# Altium project RP2040.PrjPcb
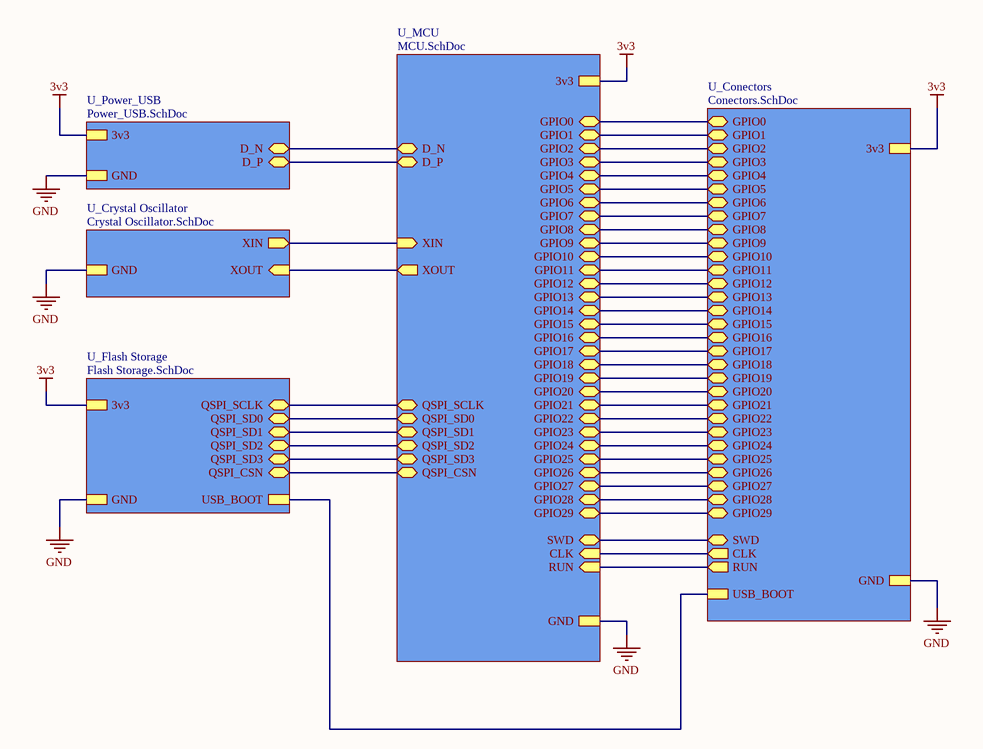
[diagram p0: RP2040.SchDoc]
6 sheets, 30 parts. Net scope: hierarchical (ports join the sheet entries above them; power ports are global).
Board file: RP2040.PcbDoc
Sheets:
  RP2040.SchDoc
    U_Conectors = Conectors.SchDoc
    U_Crystal Oscillator = Crystal Oscillator.SchDoc
    U_Flash Storage = Flash Storage.SchDoc
    U_MCU = MCU.SchDoc
    U_Power_USB = Power_USB.SchDoc

## Sheet RP2040.SchDoc
size A; SheetNumber: 1; SheetTotal: 6

### Sub-sheets
U_Conectors = Conectors.SchDoc: GPIO0 (bidir), GPIO1 (bidir), GPIO2 (bidir), GPIO3 (bidir), GPIO4 (bidir), GPIO5 (bidir), GPIO6 (bidir), GPIO7 (bidir), GPIO8 (bidir), GPIO9 (bidir), GPIO10 (bidir), GPIO11 (bidir), GPIO12 (bidir), GPIO13 (bidir), GPIO14 (bidir), GPIO15 (bidir), CLK (out), SWD (bidir), RUN (out), GPIO16 (bidir), GPIO17 (bidir), GPIO18 (bidir), GPIO19 (bidir), GPIO20 (bidir), GPIO21 (bidir), GPIO22 (bidir), GPIO23 (bidir), GPIO24 (bidir), GPIO25 (bidir), GPIO26 (bidir), GPIO27 (bidir), GPIO28 (bidir), GPIO29 (bidir), USB_BOOT, 3v3, GND
U_Crystal Oscillator = Crystal Oscillator.SchDoc: XIN (out), XOUT (in), GND
U_Flash Storage = Flash Storage.SchDoc: USB_BOOT, QSPI_SCLK (bidir), QSPI_SD0 (bidir), QSPI_SD1 (bidir), QSPI_SD2 (bidir), QSPI_SD3 (bidir), QSPI_CSN (bidir), 3v3, GND
U_MCU = MCU.SchDoc: GPIO0 (bidir), GPIO1 (bidir), GPIO2 (bidir), GPIO3 (bidir), GPIO4 (bidir), GPIO5 (bidir), GPIO6 (bidir), GPIO7 (bidir), GPIO8 (bidir), GPIO9 (bidir), GPIO10 (bidir), GPIO11 (bidir), GPIO12 (bidir), GPIO13 (bidir), GPIO14 (bidir), GPIO15 (bidir), SWD (bidir), RUN (in), GPIO16 (bidir), GPIO17 (bidir), GPIO18 (bidir), GPIO19 (bidir), GPIO20 (bidir), GPIO21 (bidir), GPIO22 (bidir), GPIO23 (bidir), GPIO24 (bidir), GPIO25 (bidir), GPIO26 (bidir), GPIO27 (bidir), GPIO28 (bidir), GPIO29 (bidir), CLK (in), XOUT (out), XIN (in), QSPI_SCLK (bidir), QSPI_SD0 (bidir), QSPI_SD1 (bidir), QSPI_SD2 (bidir), QSPI_SD3 (bidir), QSPI_CSN (bidir), 3v3, GND, D_N (bidir), D_P (bidir)
U_Power_USB = Power_USB.SchDoc: GND, 3v3, D_N (bidir), D_P (bidir)

### Nets
3v3: sheet U_Conectors/3v3, sheet U_Flash Storage/3v3, sheet U_MCU/3v3, sheet U_Power_USB/3v3
GND: sheet U_Conectors/GND, sheet U_Crystal Oscillator/GND, sheet U_Flash Storage/GND, sheet U_MCU/GND, sheet U_Power_USB/GND
CLK: sheet U_Conectors/CLK, sheet U_MCU/CLK
D_N: sheet U_MCU/D_N, sheet U_Power_USB/D_N
D_P: sheet U_MCU/D_P, sheet U_Power_USB/D_P
GPIO0: sheet U_Conectors/GPIO0, sheet U_MCU/GPIO0
GPIO1: sheet U_Conectors/GPIO1, sheet U_MCU/GPIO1
GPIO2: sheet U_Conectors/GPIO2, sheet U_MCU/GPIO2
GPIO3: sheet U_Conectors/GPIO3, sheet U_MCU/GPIO3
GPIO4: sheet U_Conectors/GPIO4, sheet U_MCU/GPIO4
GPIO5: sheet U_Conectors/GPIO5, sheet U_MCU/GPIO5
GPIO6: sheet U_Conectors/GPIO6, sheet U_MCU/GPIO6
GPIO7: sheet U_Conectors/GPIO7, sheet U_MCU/GPIO7
GPIO8: sheet U_Conectors/GPIO8, sheet U_MCU/GPIO8
GPIO9: sheet U_Conectors/GPIO9, sheet U_MCU/GPIO9
GPIO10: sheet U_Conectors/GPIO10, sheet U_MCU/GPIO10
GPIO11: sheet U_Conectors/GPIO11, sheet U_MCU/GPIO11
GPIO12: sheet U_Conectors/GPIO12, sheet U_MCU/GPIO12
GPIO13: sheet U_Conectors/GPIO13, sheet U_MCU/GPIO13
GPIO14: sheet U_Conectors/GPIO14, sheet U_MCU/GPIO14
GPIO15: sheet U_Conectors/GPIO15, sheet U_MCU/GPIO15
GPIO16: sheet U_Conectors/GPIO16, sheet U_MCU/GPIO16
GPIO17: sheet U_Conectors/GPIO17, sheet U_MCU/GPIO17
GPIO18: sheet U_Conectors/GPIO18, sheet U_MCU/GPIO18
GPIO19: sheet U_Conectors/GPIO19, sheet U_MCU/GPIO19
GPIO20: sheet U_Conectors/GPIO20, sheet U_MCU/GPIO20
GPIO21: sheet U_Conectors/GPIO21, sheet U_MCU/GPIO21
GPIO22: sheet U_Conectors/GPIO22, sheet U_MCU/GPIO22
GPIO23: sheet U_Conectors/GPIO23, sheet U_MCU/GPIO23
GPIO24: sheet U_Conectors/GPIO24, sheet U_MCU/GPIO24
GPIO25: sheet U_Conectors/GPIO25, sheet U_MCU/GPIO25
GPIO26: sheet U_Conectors/GPIO26, sheet U_MCU/GPIO26
GPIO27: sheet U_Conectors/GPIO27, sheet U_MCU/GPIO27
GPIO28: sheet U_Conectors/GPIO28, sheet U_MCU/GPIO28
GPIO29: sheet U_Conectors/GPIO29, sheet U_MCU/GPIO29
QSPI_CSN: sheet U_Flash Storage/QSPI_CSN, sheet U_MCU/QSPI_CSN
QSPI_SCLK: sheet U_Flash Storage/QSPI_SCLK, sheet U_MCU/QSPI_SCLK
QSPI_SD0: sheet U_Flash Storage/QSPI_SD0, sheet U_MCU/QSPI_SD0
QSPI_SD1: sheet U_Flash Storage/QSPI_SD1, sheet U_MCU/QSPI_SD1
QSPI_SD2: sheet U_Flash Storage/QSPI_SD2, sheet U_MCU/QSPI_SD2
QSPI_SD3: sheet U_Flash Storage/QSPI_SD3, sheet U_MCU/QSPI_SD3
RUN: sheet U_Conectors/RUN, sheet U_MCU/RUN
SWD: sheet U_Conectors/SWD, sheet U_MCU/SWD
USB_BOOT: sheet U_Conectors/USB_BOOT, sheet U_Flash Storage/USB_BOOT
XIN: sheet U_Crystal Oscillator/XIN, sheet U_MCU/XIN
XOUT: sheet U_Crystal Oscillator/XOUT, sheet U_MCU/XOUT

## Sheet Conectors.SchDoc
size A; SheetNumber: 3; SheetTotal: 6
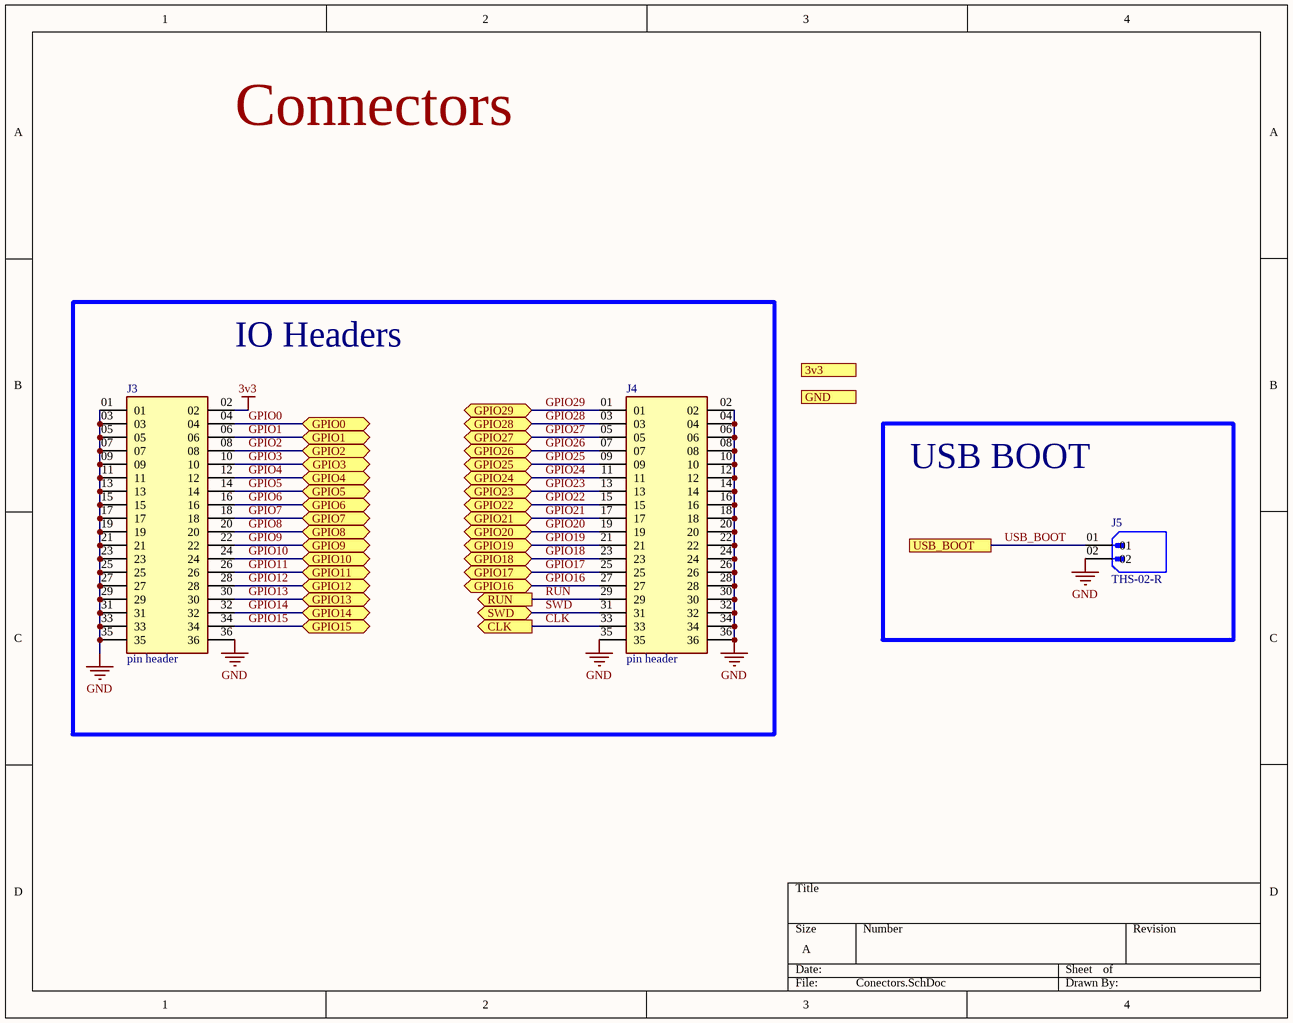
[diagram p1: Conectors.SchDoc]

### Parts
J3  pin header  [MTSW-118-07-T-D-150]
J4  pin header  [MTSW-118-07-T-D-150]
J5  THS-02-R  [THS-02-R]

### Blocks framed on the sheet
IO Headers: J3 J4
USB BOOT: J5

### Ports
3v3, CLK (out), GND, GPIO0 (bidir), GPIO1 (bidir), GPIO2 (bidir), GPIO3 (bidir), GPIO4 (bidir), GPIO5 (bidir), GPIO6 (bidir), GPIO7 (bidir), GPIO8 (bidir), GPIO9 (bidir), GPIO10 (bidir), GPIO11 (bidir), GPIO12 (bidir), GPIO13 (bidir), GPIO14 (bidir), GPIO15 (bidir), GPIO16 (bidir), GPIO17 (bidir), GPIO18 (bidir), GPIO19 (bidir), GPIO20 (bidir), GPIO21 (bidir), GPIO22 (bidir), GPIO23 (bidir), GPIO24 (bidir), GPIO25 (bidir), GPIO26 (bidir), GPIO27 (bidir), GPIO28 (bidir), GPIO29 (bidir), RUN (out), SWD (bidir), USB_BOOT

### Nets
3v3: J3.02 ; port 3v3
GND: J3.01 J3.03 J3.05 J3.07 J3.09 J3.11 J3.13 J3.15 J3.17 J3.19 J3.21 J3.23 J3.25 J3.27 J3.29 J3.31 J3.33 J3.35 J3.36 J4.02 J4.04 J4.06 J4.08 J4.10 J4.12 J4.14 J4.16 J4.18 J4.20 J4.22 J4.24 J4.26 J4.28 J4.30 J4.32 J4.34 J4.35 J4.36 J5.02 ; port GND
CLK: J4.33 ; port CLK
GPIO0: J3.04 ; port GPIO0
GPIO1: J3.06 ; port GPIO1
GPIO2: J3.08 ; port GPIO2
GPIO3: J3.10 ; port GPIO3
GPIO4: J3.12 ; port GPIO4
GPIO5: J3.14 ; port GPIO5
GPIO6: J3.16 ; port GPIO6
GPIO7: J3.18 ; port GPIO7
GPIO8: J3.20 ; port GPIO8
GPIO9: J3.22 ; port GPIO9
GPIO10: J3.24 ; port GPIO10
GPIO11: J3.26 ; port GPIO11
GPIO12: J3.28 ; port GPIO12
GPIO13: J3.30 ; port GPIO13
GPIO14: J3.32 ; port GPIO14
GPIO15: J3.34 ; port GPIO15
GPIO16: J4.27 ; port GPIO16
GPIO17: J4.25 ; port GPIO17
GPIO18: J4.23 ; port GPIO18
GPIO19: J4.21 ; port GPIO19
GPIO20: J4.19 ; port GPIO20
GPIO21: J4.17 ; port GPIO21
GPIO22: J4.15 ; port GPIO22
GPIO23: J4.13 ; port GPIO23
GPIO24: J4.11 ; port GPIO24
GPIO25: J4.09 ; port GPIO25
GPIO26: J4.07 ; port GPIO26
GPIO27: J4.05 ; port GPIO27
GPIO28: J4.03 ; port GPIO28
GPIO29: J4.01 ; port GPIO29
RUN: J4.29 ; port RUN
SWD: J4.31 ; port SWD
USB_BOOT: J5.01 ; port USB_BOOT

### Notes on the sheet
- Connectors

### Library data of the parts
J3 J4 = MTSW-118-07-T-D-150: 2x18 male pin header; Package: None; Price: None; Value: *; MP: MTSW-118-07-T-D-150; Availability: Unavailable
J5 = THS-02-R: 2x1 male pin header; Value: *; Price: None; Package: None; Availability: Unavailable; MP: THS-02-R

## Sheet Crystal Oscillator.SchDoc
size A; SheetNumber: 6; SheetTotal: 6
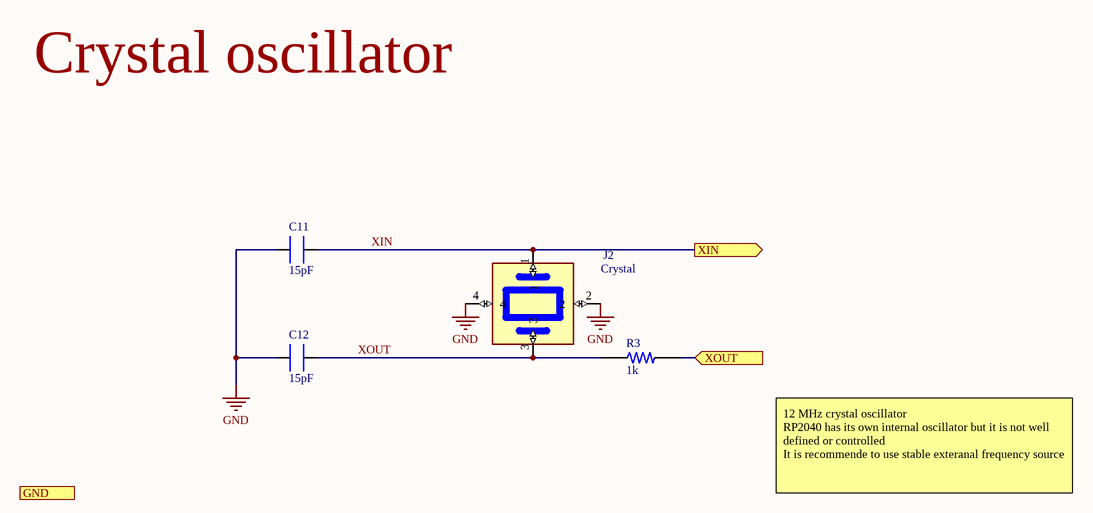
[diagram p2: Crystal Oscillator.SchDoc]

### Parts
C11  15pF  [CC0603JRNPO9BN150]
C12  15pF  [CC0603JRNPO9BN150]
J2  Crystal  [ABM8-272-T3]
R3  1k  [RC0603FR-071KL]

### Ports
GND, XIN (out), XOUT (in)

### Nets
GND: C11.2 C12.2 J2.2 J2.4 ; port GND
XIN: C11.1 J2.1 ; port XIN
XOUT: C12.1 J2.3 R3.1
XOUT: R3.2 ; port XOUT  [a separate net that carries the same name]

### Notes on the sheet
- Crystal oscillator
- 12 MHz crystal oscillator
  RP2040 has its own internal oscillator but it is not well defined or controlled
  It is recommende to use stable exteranal frequency source

### Library data of the parts
C11 C12 = CC0603JRNPO9BN150: 15pF ±5% 50V Ceramic Capacitor C0G, NP0 0603 (1608 Metric); MF: Yageo; Package: 0603 Yageo; MP: CC0603JRNPO9BN150; Purchase-URL: https://pricing.snapeda.com/search/part/CC0603JRNPO9BN150/?ref=eda; Check_prices: https://www.snapeda.com/parts/CC0603JRNPO9BN150/Yageo/view-part/105570/?ref=eda; Value: *; Price: None; Availability: Good; SnapEDA_Link: https://www.snapeda.com/parts/CC0603JRNPO9BN150/Yageo/view-part/105570/?ref=snap
J2 = ABM8-272-T3: 12 MHz  ±30ppm Crystal 10pF 50 Ohms 4-SMD, No Lead; MF: ABRACON; SnapEDA_Link: https://www.snapeda.com/parts/ABM8-272-T3/Abracon/view-part/?ref=snap; Package: SMD-4 Abracon; Value: *; MP: ABM8-272-T3; Check_prices: https://www.snapeda.com/parts/ABM8-272-T3/Abracon/view-part/?ref=eda
R3 = RC0603FR-071KL: 1 kOhms ±1% 0.1W, 1/10W Chip Resistor 0603 (1608 Metric) Moisture Resistant Thick Film; MF: Yageo; SnapEDA_Link: https://www.snapeda.com/parts/RC0603FR-071KL/Yageo/view-part/?ref=snap; Package: 0603 Yageo; Value: *; MP: RC0603FR-071KL; Check_prices: https://www.snapeda.com/parts/RC0603FR-071KL/Yageo/view-part/?ref=eda

## Sheet Flash Storage.SchDoc
size A; SheetNumber: 2; SheetTotal: 6
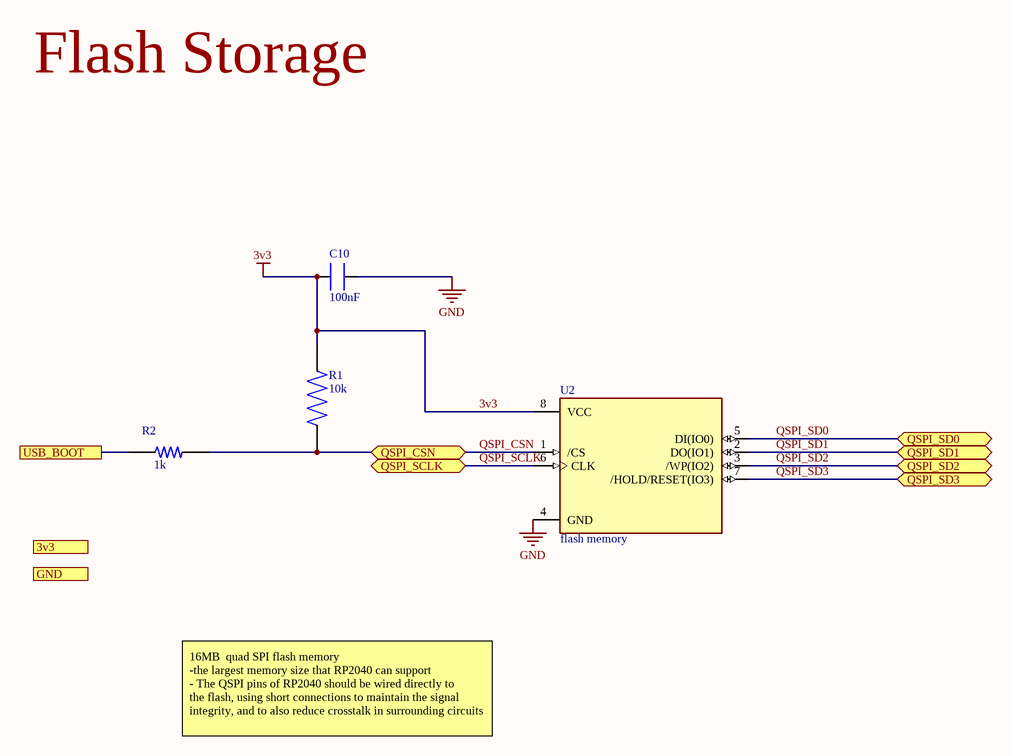
[diagram p3: Flash Storage.SchDoc]

### Parts
C10  100nF  [CL10B104KB8NNNC]
R1  10k  [RMCF0603JT10K0]
R2  1k  [RC0603FR-071KL]
U2  flash memory  [SOIC127P790X216-8N]

### Ports
3v3, GND, QSPI_CSN (bidir), QSPI_SCLK (bidir), QSPI_SD0 (bidir), QSPI_SD1 (bidir), QSPI_SD2 (bidir), QSPI_SD3 (bidir), USB_BOOT

### Nets
3v3: C10.1 R1.2 U2.8(VCC) ; port 3v3
GND: C10.2 U2.4(GND) ; port GND
QSPI_CSN: R1.1 R2.2 U2.1(/CS) ; port QSPI_CSN
QSPI_SCLK: U2.6(CLK) ; port QSPI_SCLK
QSPI_SD0: U2.5(DI(IO0)) ; port QSPI_SD0
QSPI_SD1: U2.2(DO(IO1)) ; port QSPI_SD1
QSPI_SD2: U2.3(/WP(IO2)) ; port QSPI_SD2
QSPI_SD3: U2.7(/HOLD/RESET(IO3)) ; port QSPI_SD3
USB_BOOT: R2.1 ; port USB_BOOT

### Notes on the sheet
- Flash Storage
- 16MB  quad SPI flash memory
  -the largest memory size that RP2040 can support
  - The QSPI pins of RP2040 should be wired directly to
  the flash, using short connections to maintain the signal integrity, and to also reduce crosstalk in surrounding circuits

### Library data of the parts
C10 = CL10B104KB8NNNC: SMD ceramic capacitor 0.1µF, tolerance ±10% 50V 0603 _1608 Metric_; MF: Samsung Electro-Mechanics; Price: None; MP: CL10B104KB8NNNC; SnapEDA_Link: https://www.snapeda.com/parts/CL10B104KB8NNNC/Samsung%20Electro-Mechanics/view-part/3598309/?ref=snap; Availability: Unavailable; Package: 0603 Samsung; Value: *
R1 = RMCF0603JT10K0: 10 kOhms ±5% 0.1W, 1/10W Chip Resistor 0603 (1608 Metric) Automotive AEC-Q200 Thick Film; Package: None; Price: None; Value: *; MP: RMCF0603JT10K0; Availability: Unavailable
R2 = RC0603FR-071KL: as R3 on sheet Crystal Oscillator; SnapEDA_Link: https://www.snapeda.com/parts/RC0603FR-071KL/Yageo/view-part/?ref=snap; Package: 0603 Yageo; Value: *; MP: RC0603FR-071KL; Check_prices: https://www.snapeda.com/parts/RC0603FR-071KL/Yageo/view-part/?ref=eda
U2 = W25Q128JVSIQ: FLASH - NOR Memory IC 128Mb (16M x 8) SPI - Quad I/O, QPI, DTR 133 MHz 8-SOIC; MF: Winbond Electronics; Price: None; Purchase-URL: https://pricing.snapeda.com/search/part/W25Q128JVSIQ/?ref=eda; Check_prices: https://www.snapeda.com/parts/W25Q128JVSIQ/Winbond+Electronics/view-part/?ref=eda; Value: *; MP: W25Q128JVSIQ; Package: SOIC-8 Winbond; SnapEDA_Link: https://www.snapeda.com/parts/W25Q128JVSIQ/Winbond+Electronics/view-part/?ref=snap; Availability: In Stock

## Sheet MCU.SchDoc
size A; SheetNumber: 4; SheetTotal: 6
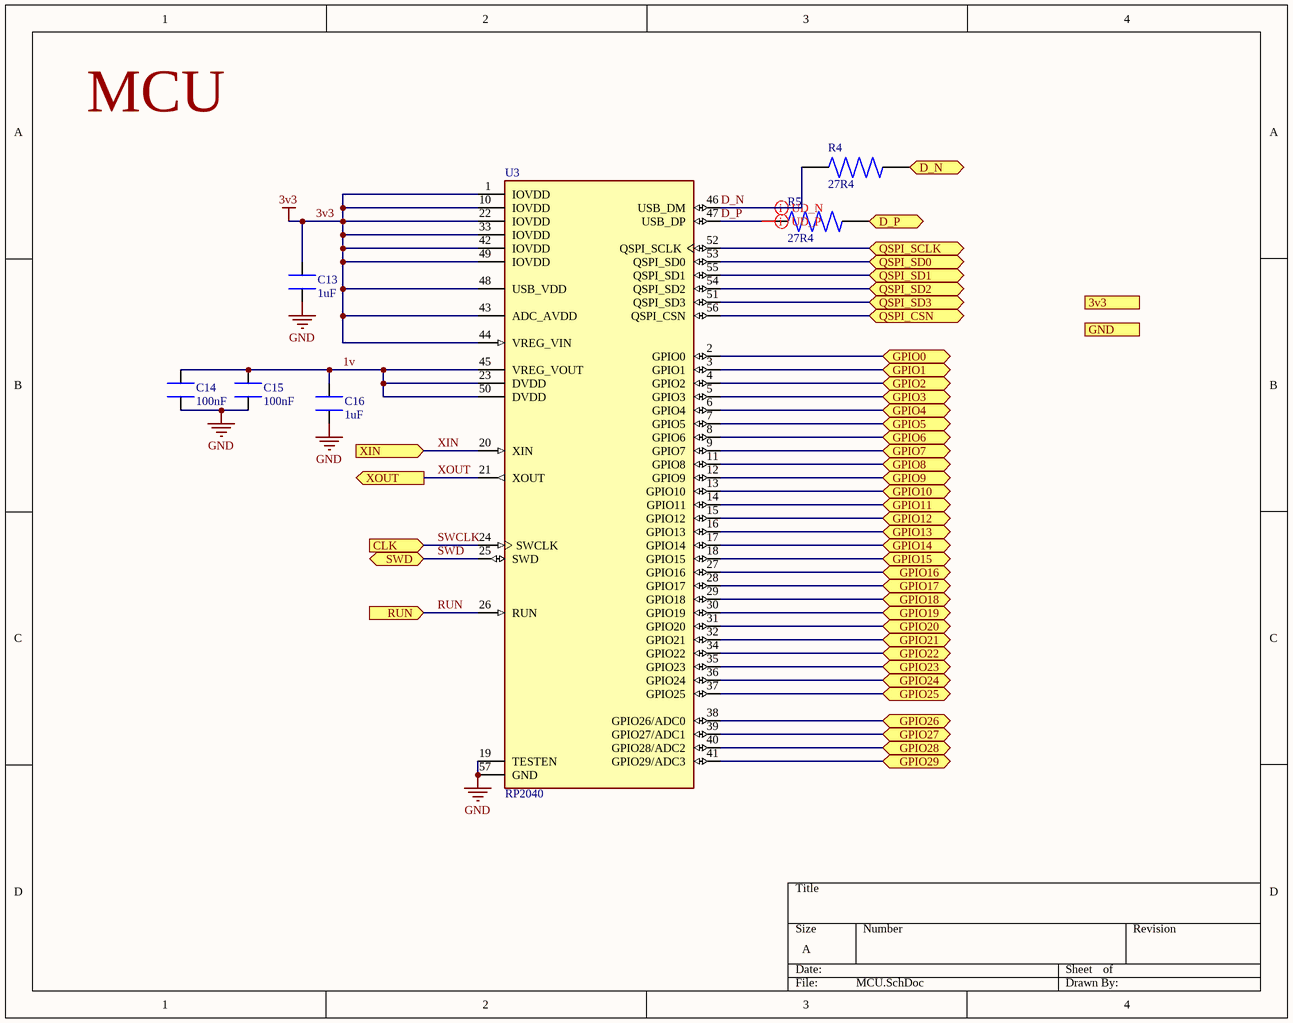
[diagram p4: MCU.SchDoc]

### Parts
C13  1uF  [CC0603KRX5R8BB105]
C14  100nF  [CL10B104KB8NNNC]
C15  100nF  [CL10B104KB8NNNC]
C16  1uF  [CC0603KRX5R8BB105]
R4  27R4  [RC0603FR-0727R4L]
R5  27R4  [RC0603FR-0727R4L]
U3  RP2040  [RP2040]

### Ports
3v3, CLK (in), D_N (bidir), D_P (bidir), GND, GPIO0 (bidir), GPIO1 (bidir), GPIO2 (bidir), GPIO3 (bidir), GPIO4 (bidir), GPIO5 (bidir), GPIO6 (bidir), GPIO7 (bidir), GPIO8 (bidir), GPIO9 (bidir), GPIO10 (bidir), GPIO11 (bidir), GPIO12 (bidir), GPIO13 (bidir), GPIO14 (bidir), GPIO15 (bidir), GPIO16 (bidir), GPIO17 (bidir), GPIO18 (bidir), GPIO19 (bidir), GPIO20 (bidir), GPIO21 (bidir), GPIO22 (bidir), GPIO23 (bidir), GPIO24 (bidir), GPIO25 (bidir), GPIO26 (bidir), GPIO27 (bidir), GPIO28 (bidir), GPIO29 (bidir), QSPI_CSN (bidir), QSPI_SCLK (bidir), QSPI_SD0 (bidir), QSPI_SD1 (bidir), QSPI_SD2 (bidir), QSPI_SD3 (bidir), RUN (in), SWD (bidir), XIN (in), XOUT (out)

### Nets
3v3: C13.1 U3.1(IOVDD) U3.10(IOVDD) U3.22(IOVDD) U3.33(IOVDD) U3.42(IOVDD) U3.43(ADC_AVDD) U3.44(VREG_VIN) U3.48(USB_VDD) U3.49(IOVDD) ; port 3v3
GND: C13.2 C14.1 C15.1 C16.2 U3.19(TESTEN) U3.57(GND) ; port GND
1v: C14.2 C15.2 C16.1 U3.23(DVDD) U3.45(VREG_VOUT) U3.50(DVDD)
D_N: R4.1 U3.46(USB_DM)
D_N: R4.2 ; port D_N  [a separate net that carries the same name]
D_P: R5.1 U3.47(USB_DP)
D_P: R5.2 ; port D_P  [a separate net that carries the same name]
GPIO0: U3.2(GPIO0) ; port GPIO0
GPIO1: U3.3(GPIO1) ; port GPIO1
GPIO2: U3.4(GPIO2) ; port GPIO2
GPIO3: U3.5(GPIO3) ; port GPIO3
GPIO4: U3.6(GPIO4) ; port GPIO4
GPIO5: U3.7(GPIO5) ; port GPIO5
GPIO6: U3.8(GPIO6) ; port GPIO6
GPIO7: U3.9(GPIO7) ; port GPIO7
GPIO8: U3.11(GPIO8) ; port GPIO8
GPIO9: U3.12(GPIO9) ; port GPIO9
GPIO10: U3.13(GPIO10) ; port GPIO10
GPIO11: U3.14(GPIO11) ; port GPIO11
GPIO12: U3.15(GPIO12) ; port GPIO12
GPIO13: U3.16(GPIO13) ; port GPIO13
GPIO14: U3.17(GPIO14) ; port GPIO14
GPIO15: U3.18(GPIO15) ; port GPIO15
GPIO16: U3.27(GPIO16) ; port GPIO16
GPIO17: U3.28(GPIO17) ; port GPIO17
GPIO18: U3.29(GPIO18) ; port GPIO18
GPIO19: U3.30(GPIO19) ; port GPIO19
GPIO20: U3.31(GPIO20) ; port GPIO20
GPIO21: U3.32(GPIO21) ; port GPIO21
GPIO22: U3.34(GPIO22) ; port GPIO22
GPIO23: U3.35(GPIO23) ; port GPIO23
GPIO24: U3.36(GPIO24) ; port GPIO24
GPIO25: U3.37(GPIO25) ; port GPIO25
GPIO26: U3.38(GPIO26/ADC0) ; port GPIO26
GPIO27: U3.39(GPIO27/ADC1) ; port GPIO27
GPIO28: U3.40(GPIO28/ADC2) ; port GPIO28
GPIO29: U3.41(GPIO29/ADC3) ; port GPIO29
QSPI_CSN: U3.56(QSPI_CSN) ; port QSPI_CSN
QSPI_SCLK: U3.52(QSPI_SCLK) ; port QSPI_SCLK
QSPI_SD0: U3.53(QSPI_SD0) ; port QSPI_SD0
QSPI_SD1: U3.55(QSPI_SD1) ; port QSPI_SD1
QSPI_SD2: U3.54(QSPI_SD2) ; port QSPI_SD2
QSPI_SD3: U3.51(QSPI_SD3) ; port QSPI_SD3
RUN: U3.26(RUN) ; port RUN
SWCLK: U3.24(SWCLK) ; port CLK  [project net CLK]
SWD: U3.25(SWD) ; port SWD
XIN: U3.20(XIN) ; port XIN
XOUT: U3.21(XOUT) ; port XOUT

### Layout directives
differential pair; differential pair class UDiff: D_N, D_P

### Notes on the sheet
- MCU

### Library data of the parts
C13 C16 = CC0603KRX5R8BB105: SMD ceramic capasitor 1uF; MF: Yageo; SnapEDA_Link: https://www.snapeda.com/parts/CC0603KRX5R8BB105/Yageo/view-part/1820893/?ref=snap; Package: 0603 Yageo; Price: None; Value: *; MP: CC0603KRX5R8BB105; Availability: Unavailable
C14 C15 = CL10B104KB8NNNC: as C10 on sheet Flash Storage; Price: None; MP: CL10B104KB8NNNC; SnapEDA_Link: https://www.snapeda.com/parts/CL10B104KB8NNNC/Samsung%20Electro-Mechanics/view-part/3598309/?ref=snap; Availability: Unavailable; Package: 0603 Samsung; Value: *
R4 R5 = RC0603FR-0727R4L: RES SMD 27.4 OHM 1% 1/10W 0603; Package: None; Price: None; Value: *; MP: RC0603FR-0727R4L; Availability: Unavailable
U3 = RP2040: RP2040 chip for Raspberry Pi Pico - ARM® Cortex®-M0+ MCU 32-Bit; SnapEDA_Link: https://www.snapeda.com/parts/RP2040/Raspberry+Pi/view-part/?ref=snap; Package: None; Value: *; MF: Raspberry Pi; MP: RP2040; Check_prices: https://www.snapeda.com/parts/RP2040/Raspberry+Pi/view-part/?ref=eda

## Sheet Power_USB.SchDoc
size A; SheetNumber: 1; SheetTotal: 6
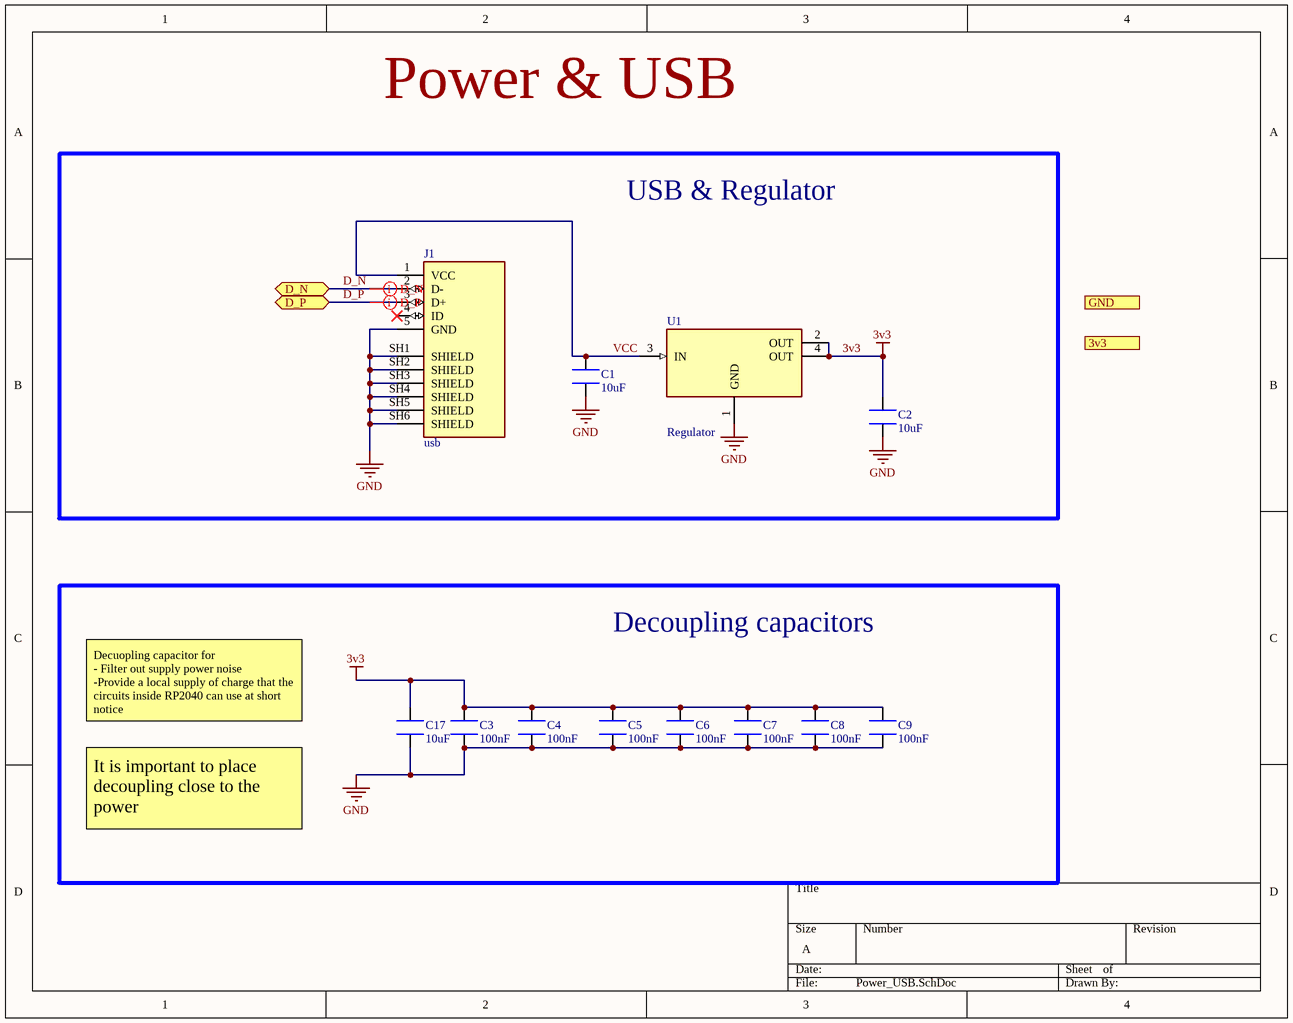
[diagram p5: Power_USB.SchDoc]

### Parts
C1  10uF  [CL21A106KOQNNNG]
C2  10uF  [CL21A106KOQNNNG]
C3  100nF  [CL10B104KB8NNNC]
C4  100nF  [CL10B104KB8NNNC]
C5  100nF  [CL10B104KB8NNNC]
C6  100nF  [CL10B104KB8NNNC]
C7  100nF  [CL10B104KB8NNNC]
C8  100nF  [CL10B104KB8NNNC]
C9  100nF  [CL10B104KB8NNNC]
C17  10uF  [CL21A106KOQNNNG]
J1  usb  [AMPHENOL_10118194-0001LF]
U1  Regulator  [SOT230P700X180-4N]

### Blocks framed on the sheet
USB & Regulator: C1 C2 J1 U1
Decoupling capacitors: C3-C9 C17

### Ports
3v3, D_N (bidir), D_P (bidir), GND

### Nets
3v3: C2.2 C3.2 C4.2 C5.2 C6.2 C7.2 C8.2 C9.2 C17.2 U1.2(OUT) U1.4(OUT) ; port 3v3
GND: C1.1 C2.1 C3.1 C4.1 C5.1 C6.1 C7.1 C8.1 C9.1 C17.1 J1.5(GND) J1.SH1(SHIELD) J1.SH2(SHIELD) J1.SH3(SHIELD) J1.SH4(SHIELD) J1.SH5(SHIELD) J1.SH6(SHIELD) U1.1(GND) ; port GND
D_N: J1.2(D-) ; port D_N
D_P: J1.3(D+) ; port D_P
VCC: C1.2 J1.1(VCC) U1.3(IN)

Not connected (* = marked no-connect by the designer): J1 4(ID)*

### Layout directives
differential pair; differential pair class Diff90: D_N, D_P

### Notes on the sheet
- Power & USB
- 90 ohm deffrential imbedance for  USB
- Decuopling capacitor for
  - Filter out supply power noise
  -Provide a local supply of charge that the circuits inside RP2040 can use at short notice
- It is important to place decoupling close to the power
  pins

### Library data of the parts
C1 C2 C17 = CL21A106KOQNNNG: SMD ceramic capacitor 10µF, tolerance±10% 16V  X5R 0805 _2012 Metric; MF: Samsung Electro-Mechanics; Package: 0805 Samsung; Digi-Key_Part_Number: 1276-6455-1-ND; Digi-Key_Purchase_URL: https://www.digikey.com/product-detail/en/samsung-electro-mechanics/CL21A106KOQNNNG/1276-6455-1-ND/5958083?utm_source=snapeda&utm_medium=aggregator&utm_campaign=symbol; Value: *; MP: CL21A106KOQNNNG; SnapEDA_Link: https://www.snapeda.com/parts/CL21A106KOQNNNG/Samsung%20Electro-Mechanics/view-part/3597829/?ref=snap
C3-C9 = CL10B104KB8NNNC: as C10 on sheet Flash Storage; Price: None; MP: CL10B104KB8NNNC; SnapEDA_Link: https://www.snapeda.com/parts/CL10B104KB8NNNC/Samsung%20Electro-Mechanics/view-part/3598309/?ref=snap; Availability: Unavailable; Package: 0603 Samsung; Value: *
J1 = 10118194-0001LF: Micro USB, Input Output Connectors, B TYPE RECEPTACLE with flange; MF: Amphenol ICC; SnapEDA_Link: https://www.snapeda.com/parts/10118194-0001LF/Amphenol+FCI/view-part/?ref=snap; Package: None; Value: *; MP: 10118194-0001LF; Check_prices: https://www.snapeda.com/parts/10118194-0001LF/Amphenol+FCI/view-part/?ref=eda
U1 = NCP1117ST50T3G: Linear Voltage Regulator IC 1 Output 1A SOT-223; MF: ON Semiconductor; MP: NCP1117ST50T3G; Package: TO-261-4 ON Semiconductor; Price: None; Value: *; SnapEDA_Link: https://www.snapeda.com/parts/NCP1117ST50T3G/ON%20Semiconductor/view-part/836318/?ref=snap; Availability: Unavailable

## Nets that join several sheets
3v3: Conectors (J3.02), Flash Storage (C10.1 R1.2 U2.8), MCU (10 pins), Power_USB (11 pins)
GND: Conectors (39 pins), Crystal Oscillator (C11.2 C12.2 J2.2 J2.4), Flash Storage (C10.2 U2.4), MCU (6 pins), Power_USB (18 pins)
CLK: Conectors (J4.33), MCU (U3.24)
D_N: MCU (R4.2), Power_USB (J1.2)
D_P: MCU (R5.2), Power_USB (J1.3)
GPIO0: Conectors (J3.04), MCU (U3.2)
GPIO1: Conectors (J3.06), MCU (U3.3)
GPIO2: Conectors (J3.08), MCU (U3.4)
GPIO3: Conectors (J3.10), MCU (U3.5)
GPIO4: Conectors (J3.12), MCU (U3.6)
GPIO5: Conectors (J3.14), MCU (U3.7)
GPIO6: Conectors (J3.16), MCU (U3.8)
GPIO7: Conectors (J3.18), MCU (U3.9)
GPIO8: Conectors (J3.20), MCU (U3.11)
GPIO9: Conectors (J3.22), MCU (U3.12)
GPIO10: Conectors (J3.24), MCU (U3.13)
GPIO11: Conectors (J3.26), MCU (U3.14)
GPIO12: Conectors (J3.28), MCU (U3.15)
GPIO13: Conectors (J3.30), MCU (U3.16)
GPIO14: Conectors (J3.32), MCU (U3.17)
GPIO15: Conectors (J3.34), MCU (U3.18)
GPIO16: Conectors (J4.27), MCU (U3.27)
GPIO17: Conectors (J4.25), MCU (U3.28)
GPIO18: Conectors (J4.23), MCU (U3.29)
GPIO19: Conectors (J4.21), MCU (U3.30)
GPIO20: Conectors (J4.19), MCU (U3.31)
GPIO21: Conectors (J4.17), MCU (U3.32)
GPIO22: Conectors (J4.15), MCU (U3.34)
GPIO23: Conectors (J4.13), MCU (U3.35)
GPIO24: Conectors (J4.11), MCU (U3.36)
GPIO25: Conectors (J4.09), MCU (U3.37)
GPIO26: Conectors (J4.07), MCU (U3.38)
GPIO27: Conectors (J4.05), MCU (U3.39)
GPIO28: Conectors (J4.03), MCU (U3.40)
GPIO29: Conectors (J4.01), MCU (U3.41)
QSPI_CSN: Flash Storage (R1.1 R2.2 U2.1), MCU (U3.56)
QSPI_SCLK: Flash Storage (U2.6), MCU (U3.52)
QSPI_SD0: Flash Storage (U2.5), MCU (U3.53)
QSPI_SD1: Flash Storage (U2.2), MCU (U3.55)
QSPI_SD2: Flash Storage (U2.3), MCU (U3.54)
QSPI_SD3: Flash Storage (U2.7), MCU (U3.51)
RUN: Conectors (J4.29), MCU (U3.26)
SWD: Conectors (J4.31), MCU (U3.25)
USB_BOOT: Conectors (J5.01), Flash Storage (R2.1)
XIN: Crystal Oscillator (C11.1 J2.1), MCU (U3.20)
XOUT: Crystal Oscillator (R3.2), MCU (U3.21)